# Altium schematic sheet OpenRing_RGB.SchDoc
size A4; Size: A4; SheetNumber: 6; SheetTotal: 9
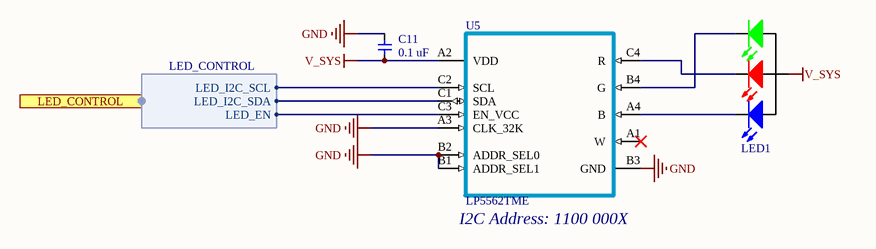
[diagram p0: OpenRing_RGB.SchDoc]

## Parts
C11  0.1 uF  [CAPC1005X05N]
LED1  SML-LX0404SIUPGUSB  [SML-LX0404SIUPGUSB]  (value not drawn)
U5  LP5562TME  [BGA12C40P4X3_162X122X68]

## Ports
LED_CONTROL (harness LED_CONTROL)

## Harnesses
LED_CONTROL: LED_I2C_SCL, LED_I2C_SDA, LED_EN

## Nets
GND: C11.2 U5.A3(CLK_32K) U5.B1(ADDR_SEL1) U5.B2(ADDR_SEL0) U5.B3(GND)
V_SYS: C11.1 LED1.1(A) U5.A2(VDD)
NetLED1_2: LED1.2(K) U5.C4(R)
NetLED1_3: LED1.3(K) U5.A4(B)
NetLED1_4: LED1.4(K) U5.B4(G)
NetU5_C1: U5.C1(SDA) ; port LED_CONTROL.LED_I2C_SDA
NetU5_C2: U5.C2(SCL) ; port LED_CONTROL.LED_I2C_SCL
NetU5_C3: U5.C3(EN_VCC) ; port LED_CONTROL.LED_EN

Not connected (* = marked no-connect by the designer): U5 A1(W)*

## Notes on the sheet
- (near U5) I2C Address: 1100 000X
- Designer/Engineer
- Drawn By
- Document Name
- Board Title
- Sheet
- of
- Size
- A4
- Approved By
- Rev.
- Date

## Library data of the parts
C11 = GRM155R61C104KA88D: CAP CER 0.1UF 16V X5R 0402; Manufacturer: Murata Electronics; Tolerance: 10 %; Type: Chip Multilayer Ceramic Capacitor for General Purpose; Voltage Rating DC: 16 VDC; Capacitance - nF: 100 nF; Capacitance - pF: 100000 pF; Supplier 1: Mouser; Manufacturer Part Number: GRM155R61C104KA88D; RoHS: RoHS Compliant; Category: Multilayer Ceramic Capacitors MLCC - SMD/SMT; Packaging: Cut Tape; Capacitance: 0.1 uF; Package / Case: 0402 (1005 metric); ComponentLink1URL: http://www.mouser.com/datasheet/2/281/murata_03052018_GRM_Series_1-1310166.pdf; ComponentLink1Description: http://www.mouser.com/datasheet/2/281/murata_03052018_GRM_Series_1-1310166.pdf; Supplier Part Number 1: 81-GRM155R61C104KA8D; Value: 0.1 uF; Stock: 0; Pricing: 1=0.082, 10=0.026, 100=0.011, 500=0.008, 1000=0.007, 2500=0.006, 5000=0.005, 10000=0.004 (EUR); Height: 0.5 mm; Length: 1 mm; Product: General Type MLCCs; Series: GRM; Termination Style: SMD/SMT; Width: 0.5 mm; Brand: Murata Electronics; Case Code - in: 0402; Case Code - mm: 1005; Dielectric: X5R; Maximum Operating Temperature: + 85 C; Minimum Operating Temperature: - 55 C; Standard Pack Qty: 10000; Termination: Standard; RoHS - Mouser: Y; Minimum Order Quantity: 1; Reeling: True; Supplier 2: Digikey; Supplier Part Number 2: 490-5415-1-ND; Supplier 3: Digikey; Supplier Part Number 3: 490-5415-6-ND
LED1 = SML-LX0404SIUPGUSB: LED Low-Power Tri-Color Blue/Green/Red 465nm/518nm/632nm 2.7V/2.75V/1.95V 4-Pin SMD T/R; Manufacturer: Lumex; Color: Blue,Green,Red; Lens Color: Colorless; Lens Transparency: Clear; Viewing Angle: 120°; Lens Style: Square,Clear,Rectangular; Forward Current: 2mA; Luminous Intensity: 20mcd; Forward Voltage: 2.73V; Number of LEDs: 3; Wavelength: 465nm; Power Rating: 30mW; Reverse Voltage: 5V; Manufacturer Part Number: SML-LX0404SIUPGUSB; RoHS: Yes; Category: LEDs; Packaging: Tape and Reel; ComponentLink1URL: https://datasheet.ciiva.com/1246/1423960-1246392.pdf?src-supplier=Element14; ComponentLink1Description: https://datasheet.ciiva.com/1246/1423960-1246392.pdf?src-supplier=Element14; Supplier: Mouser; Supplier Part Number: 696-LX0404SIUPGUSB; Stock: 113976; Pricing: 1=0.94, 10=0.633, 50=0.633, 100=0.518, 1000=0.444, 10000=0.371 (USD); Mounting Technology: Surface Mount; Case/Package: 0404; Case Code (Metric): 1010; Case Code (Imperial): 0404; Min Operating Temperature: -40°C; Max Operating Temperature: 85°C; Package Quantity: 2000; Test Current: 2mA; Series: -; Moisture Sensitivity Level: 4; Length: 1mm; Width: 1mm; Height: 0.3mm; Reach SVHC Compliant: No; Lead Free: Lead Free; RoHS Compliant: Yes; ComponentLink2URL: https://datasheet.ciiva.com/1333/lumex-quasarbrite-0404smdrgb-productbrochure-1333009.pdf?src-supplier=Newark; ComponentLink2Description: https://datasheet.ciiva.com/1333/lumex-quasarbrite-0404smdrgb-productbrochure-1333009.pdf?src-supplier=Newark; ComponentLink3URL: https://datasheet.ciiva.com/2118/sml-lx0404siupgusb-2118652.pdf?src-supplier=Digikey; ComponentLink3Description: https://datasheet.ciiva.com/2118/sml-lx0404siupgusb-2118652.pdf?src-supplier=Digikey; ComponentLink4URL: https://datasheet.ciiva.com/4689/sml-lx0404siupgusb-202559-4689572.pdf?src-supplier=Mouser; ComponentLink4Description: https://datasheet.ciiva.com/4689/sml-lx0404siupgusb-202559-4689572.pdf?src-supplier=Mouser; ComponentLink5URL: https://datasheet.ciiva.com/16199/sml-lx0404siupgusb-16199820.pdf?src-supplier=Future+Electronics; ComponentLink5Description: https://datasheet.ciiva.com/16199/sml-lx0404siupgusb-16199820.pdf?src-supplier=Future+Electronics; ComponentLink6URL: https://datasheet.ciiva.com/1246/1484526-1246779.pdf?src-supplier=Element14; ComponentLink6Description: https://datasheet.ciiva.com/1246/1484526-1246779.pdf?src-supplier=Element14; ComponentLink7URL: https://datasheet.ciiva.com/2118/sml-lx0404siupgusb-2118653.pdf?src-supplier=Digikey; ComponentLink7Description: https://datasheet.ciiva.com/2118/sml-lx0404siupgusb-2118653.pdf?src-supplier=Digikey; ComponentLink8URL: https://datasheet.ciiva.com/2118/sml-lx0404siupgusb-2118654.pdf?src-supplier=Digikey; ComponentLink8Description: https://datasheet.ciiva.com/2118/sml-lx0404siupgusb-2118654.pdf?src-supplier=Digikey; ComponentLink9URL: https://datasheet.ciiva.com/14604/70127422-14604949.pdf?src-supplier=Allied+Electronics; ComponentLink9Description: https://datasheet.ciiva.com/14604/70127422-14604949.pdf?src-supplier=Allied+Electronics
U5 = LP5562TME/NOPB: IC LED DRIVER LINEAR DIM 25.5MA; Manufacturer: Texas Instruments; Internal Switch(s): Yes; Number of Outputs: 4; Voltage - Supply (Min): 2.7V; Voltage - Supply (Max): 5.5V; Frequency: 256kHz, 558kHz; Dimming: I²C; Supplier 1: Digi-Key; Manufacturer Part Number: LP5562TME/NOPB; RoHS: RoHS Compliant; Category: Integrated Circuits (ICs); Stock 1: 4154; Pricing 1: 1=1.34, 10=1.195, 100=0.9314 (USD); Packaging: Digi-Reel®; Part Status: Active; Type: Linear; Topology: -; Voltage - Output: -; Current - Output / Channel: 25.5mA; Applications: Backlight; Operating Temperature: -40°C ~ 85°C (TA); Mounting Type: Surface Mount; Package / Case: 12-WFBGA, DSBGA; Supplier Device Package: 12-DSBGA; ComponentLink1URL: http://www.ti.com/lit/ds/symlink/lp5562.pdf; ComponentLink1Description: http://www.ti.com/lit/ds/symlink/lp5562.pdf; Supplier Part Number 1: 296-39060-6-ND